# Altium schematic sheet MCU.SchDoc
size 297 x 209 mm
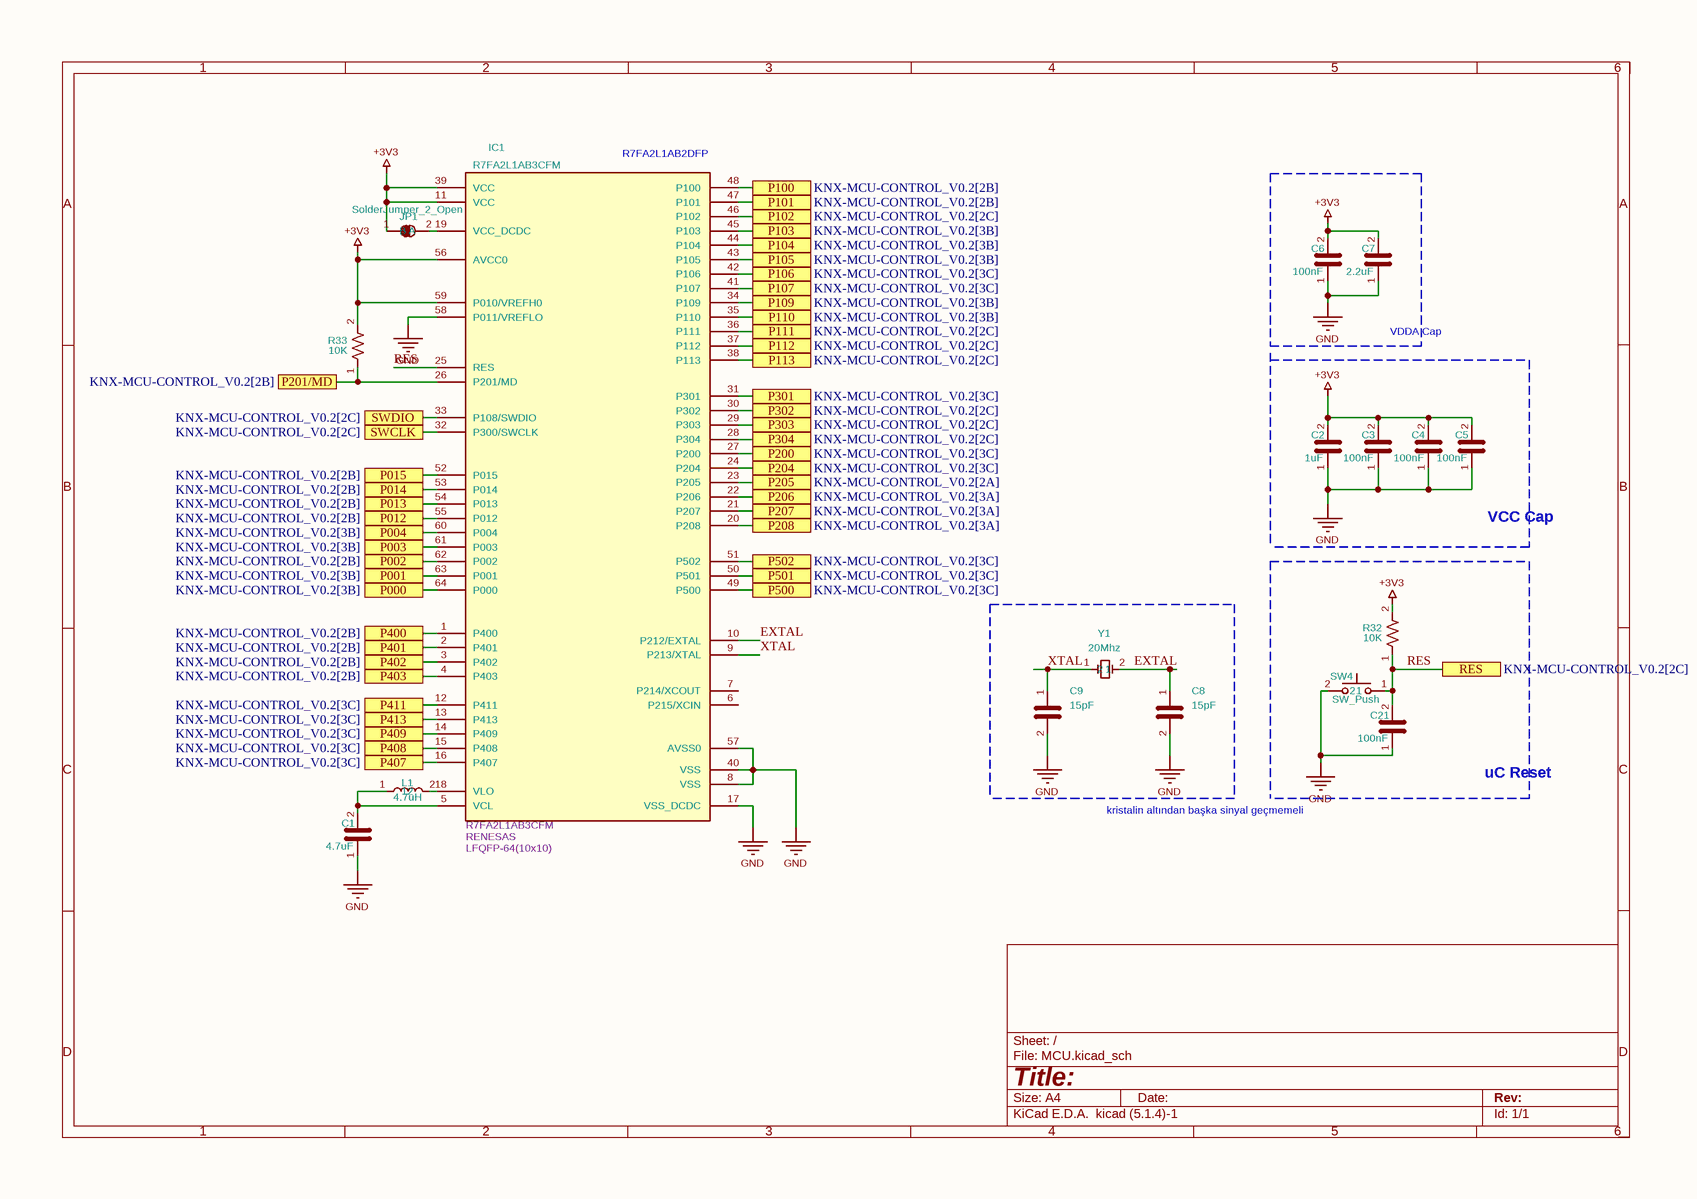
[diagram p0: MCU.SchDoc]

## Parts
C1  4.7uF  [C_0603_1608Metric]
C2  1uF  [C_0603_1608Metric]
C3  100nF  [C_0603_1608Metric]
C4  100nF  [C_0603_1608Metric]
C5  100nF  [C_0603_1608Metric]
C6  100nF  [C_0603_1608Metric]
C7  2.2uF  [C_0603_1608Metric]
C8  15pF  [C_0603_1608Metric]
C9  15pF  [C_0603_1608Metric]
C21  100nF  [C_0603_1608Metric]
IC1  Manufacturer: RENESAS  Package: LFQFP-64(10x10)  [LQFP-64_10x10mm_P0.5mm]  (hidden comment: R7FA2L1AB3CFM)
JP1  SolderJumper_2_Open  [SolderJumper-2_P1.3mm_Open_TrianglePad1.0x1.5mm]  (no BOM)
L1  4.7uH  [L_APV_ANR5012]
R32  10K  [R_0603_1608Metric]
R33  10K  [R_0603_1608Metric]
SW4  value SW_Push  [SW_SPST_CK_RS282G05A3]  (hidden comment: HX 3x6x2.5A-2.5N)
Y1  20Mhz  [Crystal_SMD_SeikoEpson_FA238-4Pin_3.2x2.5mm]

## Blocks framed on the sheet
VDDA Cap: C6 C7
uC Reset: C21 R32 SW4

## Ports
P000 (see KNX-MCU-CONTROL_V0.2[3B]), P001 (see KNX-MCU-CONTROL_V0.2[3B]), P002 (see KNX-MCU-CONTROL_V0.2[2B]), P003 (see KNX-MCU-CONTROL_V0.2[3B]), P004 (see KNX-MCU-CONTROL_V0.2[3B]), P012 (see KNX-MCU-CONTROL_V0.2[2B]), P013 (see KNX-MCU-CONTROL_V0.2[2B]), P014 (see KNX-MCU-CONTROL_V0.2[2B]), P015 (see KNX-MCU-CONTROL_V0.2[2B]), P100 (see KNX-MCU-CONTROL_V0.2[2B]), P101 (see KNX-MCU-CONTROL_V0.2[2B]), P102 (see KNX-MCU-CONTROL_V0.2[2C]), P103 (see KNX-MCU-CONTROL_V0.2[3B]), P104 (see KNX-MCU-CONTROL_V0.2[3B]), P105 (see KNX-MCU-CONTROL_V0.2[3B]), P106 (see KNX-MCU-CONTROL_V0.2[3C]), P107 (see KNX-MCU-CONTROL_V0.2[3C]), P109 (see KNX-MCU-CONTROL_V0.2[3B]), P110 (see KNX-MCU-CONTROL_V0.2[3B]), P111 (see KNX-MCU-CONTROL_V0.2[2C]), P112 (see KNX-MCU-CONTROL_V0.2[2C]), P113 (see KNX-MCU-CONTROL_V0.2[2C]), P200 (see KNX-MCU-CONTROL_V0.2[3C]), P201/MD (see KNX-MCU-CONTROL_V0.2[2B]), P204 (see KNX-MCU-CONTROL_V0.2[3C]), P205 (see KNX-MCU-CONTROL_V0.2[2A]), P206 (see KNX-MCU-CONTROL_V0.2[3A]), P207 (see KNX-MCU-CONTROL_V0.2[3A]), P208 (see KNX-MCU-CONTROL_V0.2[3A]), P301 (see KNX-MCU-CONTROL_V0.2[3C]), P302 (see KNX-MCU-CONTROL_V0.2[2C]), P303 (see KNX-MCU-CONTROL_V0.2[2C]), P304 (see KNX-MCU-CONTROL_V0.2[2C]), P400 (see KNX-MCU-CONTROL_V0.2[2B]), P401 (see KNX-MCU-CONTROL_V0.2[2B]), P402 (see KNX-MCU-CONTROL_V0.2[2B]), P403 (see KNX-MCU-CONTROL_V0.2[2B]), P407 (see KNX-MCU-CONTROL_V0.2[3C]), P408 (see KNX-MCU-CONTROL_V0.2[3C]), P409 (see KNX-MCU-CONTROL_V0.2[3C]), P411 (see KNX-MCU-CONTROL_V0.2[3C]), P413 (see KNX-MCU-CONTROL_V0.2[3C]), P500 (see KNX-MCU-CONTROL_V0.2[3C]), P501 (see KNX-MCU-CONTROL_V0.2[3C]), P502 (see KNX-MCU-CONTROL_V0.2[3C]), RES (see KNX-MCU-CONTROL_V0.2[2C]), SWCLK (see KNX-MCU-CONTROL_V0.2[2C]), SWDIO (see KNX-MCU-CONTROL_V0.2[2C])

## Nets
+3V3: C2.2 C3.2 C4.2 C5.2 C6.2 C7.2 IC1.11(VCC) IC1.39(VCC) IC1.56(AVCC0) IC1.59(P010/VREFH0) JP1.1(A) R32.2 R33.2
GND: C1.1 C2.1 C3.1 C4.1 C5.1 C6.1 C7.1 C8.2 C9.2 C21.1 IC1.8(VSS) IC1.17(VSS_DCDC) IC1.40(VSS) IC1.57(AVSS0) IC1.58(P011/VREFLO) SW4.2
EXTAL: C8.1 IC1.10(P212/EXTAL) Y1.2
P000: IC1.64(P000) ; port P000
P001: IC1.63(P001) ; port P001
P002: IC1.62(P002) ; port P002
P003: IC1.61(P003) ; port P003
P004: IC1.60(P004) ; port P004
P012: IC1.55(P012) ; port P012
P013: IC1.54(P013) ; port P013
P014: IC1.53(P014) ; port P014
P015: IC1.52(P015) ; port P015
P100: IC1.48(P100) ; port P100
P101: IC1.47(P101) ; port P101
P102: IC1.46(P102) ; port P102
P103: IC1.45(P103) ; port P103
P104: IC1.44(P104) ; port P104
P105: IC1.43(P105) ; port P105
P106: IC1.42(P106) ; port P106
P107: IC1.41(P107) ; port P107
P109: IC1.34(P109) ; port P109
P110: IC1.35(P110) ; port P110
P111: IC1.36(P111) ; port P111
P112: IC1.37(P112) ; port P112
P113: IC1.38(P113) ; port P113
P200: IC1.27(P200) ; port P200
P201/MD: IC1.26(P201/MD) R33.1 ; port P201/MD
P204: IC1.24(P204) ; port P204
P205: IC1.23(P205) ; port P205
P206: IC1.22(P206) ; port P206
P207: IC1.21(P207) ; port P207
P208: IC1.20(P208) ; port P208
P301: IC1.31(P301) ; port P301
P302: IC1.30(P302) ; port P302
P303: IC1.29(P303) ; port P303
P304: IC1.28(P304) ; port P304
P400: IC1.1(P400) ; port P400
P401: IC1.2(P401) ; port P401
P402: IC1.3(P402) ; port P402
P403: IC1.4(P403) ; port P403
P407: IC1.16(P407) ; port P407
P408: IC1.15(P408) ; port P408
P409: IC1.14(P409) ; port P409
P411: IC1.12(P411) ; port P411
P413: IC1.13(P413) ; port P413
P500: IC1.49(P500) ; port P500
P501: IC1.50(P501) ; port P501
P502: IC1.51(P502) ; port P502
RES: C21.2 IC1.25(RES) R32.1 SW4.1 ; port RES
SWCLK: IC1.32(P300/SWCLK) ; port SWCLK
SWDIO: IC1.33(P108/SWDIO) ; port SWDIO
XTAL: C9.1 IC1.9(P213/XTAL) Y1.1
NetC1_2: C1.2 IC1.5(VCL) L1.1
NetIC1_18: IC1.18(VLO) L1.2
NetIC1_19: IC1.19(VCC_DCDC) JP1.2(B)

Not connected (* = marked no-connect by the designer): IC1 6(P215/XCIN) 7(P214/XCOUT)

## Notes on the sheet
- (near IC1) R7FA2L1AB2DFP
- VCC Cap
- kristalin altından başka sinyal geçmemeli
- 1
- 2
- 3
- 4
- 5
- 6
- A
- B
- C
- D
- Title:
- File: MCU.kicad_sch
- Sheet: /
- KiCad E.D.A.  kicad (5.1.4)-1
- Size: A4
- Date:
- Rev:
- Id: 1/1

## Library data of the parts
C1 = C_3: Manufacturer Part Number: CL10B475KQ8NQNC; Manufacturer: Samsung Electro-Mechanics; Package: C_0603; Value: 4.7uF; Footprint: Capacitor_SMD:C_0603_1608Metric
C2 = C_3: Manufacturer Part Number: CL10B105KP8NNNC; Manufacturer: Samsung Electro-Mechanics; Package: C_0603; Value: 1uF; Footprint: Capacitor_SMD:C_0603_1608Metric
C3-C6 C21 = C_3: Manufacturer Part Number: CC0603KRX7R9BB104; Manufacturer: YAGEO; Package: C_0603; Value: 100nF; Footprint: Capacitor_SMD:C_0603_1608Metric
C7 = C_3: Manufacturer Part Number: CL10B225KP8NNNC; Manufacturer: Samsung Electro-Mechanics; Package: C_0603; Value: 2.2uF; Footprint: Capacitor_SMD:C_0603_1608Metric
C8 C9 = 20pF_0402_50V_5%: Manufacturer Part Number: CL10C150JB8NNNC; Manufacturer: Samsung Electro-Mechanics; Package: C0603; Value: 15pF; Footprint: Capacitor_SMD:C_0603_1608Metric
L1 = L: Manufacturer: VIKING; Manufacturer Part Number: PCD0302MT4R7; Package: Non Standard; Value: 4.7uH; Footprint: Inductor_SMD:L_APV_ANR5012
R32 R33 = R_US: Manufacturer Part Number: FRC0603J103TS; Manufacturer: FOJAN; Package: R_0603; Value: 10K; Footprint: Resistor_SMD:R_0603_1608Metric
SW4 = SW_Push: SWITCH TACTILE SPST 250gf SMD; Manufacturer: hanxia; Manufacturer Part Number: HX 3x6x2.5A-2.5N; Footprint: Button_Switch_SMD:SW_SPST_CK_RS282G05A3
Y1 = Crystal: Manufacturer Part Number: FL3P2X2P5SSC; Manufacturer: RALTRON; Package: 4-SMD 3225; Value: 20Mhz; Footprint: Crystal:Crystal_SMD_SeikoEpson_FA238-4Pin_3.2x2.5mm
IC1 = R7FA2L1AB3CFM: Manufacturer Part Number: R7FA2L1AB3CFM; Value: R7FA2L1AB3CFM; Footprint: Package_QFP:LQFP-64_10x10mm_P0.5mm
JP1 = SolderJumper_2_Open: Value: SolderJumper_2_Open; Footprint: Jumper:SolderJumper-2_P1.3mm_Open_TrianglePad1.0x1.5mm